# Altium project RoboBallPCB.PrjPcb
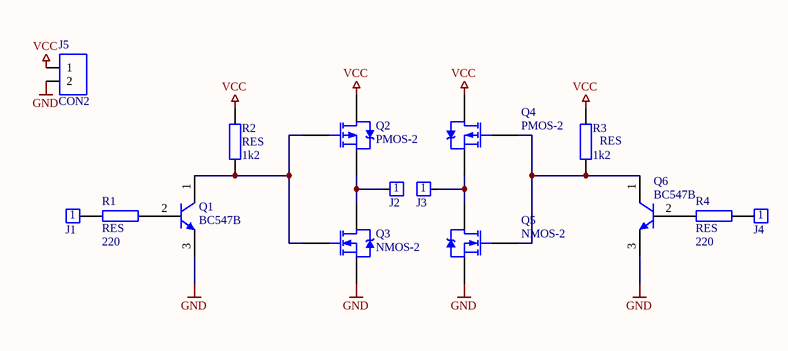
[diagram p0: RoboBallPCB.SchDoc]
1 sheet, 15 parts. Net scope: global (net labels, ports and power ports of the same name join across sheets).
Board file: RoboBallPCB.PcbDoc

## Sheet RoboBallPCB.SchDoc
size A4

### Parts
J1  CON1  [Pin1]  (value not drawn)
J2  CON1  [Pin1]  (value not drawn)
J3  CON1  [Pin1]  (value not drawn)
J4  CON1  [Pin1]  (value not drawn)
J5  CON2  [SIP-2]
Q1  BC547B  [TO-92/EBC]
Q2  PMOS-2  [TO-220AB]
Q3  NMOS-2  [TO-220AB]
Q4  PMOS-2  [TO-220AB]
Q5  NMOS-2  [TO-220AB]
Q6  BC547B  [TO-92/EBC]
R1  RES  value 220  [Axial-0.4]
R2  RES  value 1k2  [Axial-0.4]
R3  RES  value 1k2  [Axial-0.4]
R4  RES  value 220  [Axial-0.4]

### Nets
GND: J5.2 Q1.3(E) Q3.3(S) Q5.3(S) Q6.3(E)
VCC: J5.1 Q2.2(D) Q4.2(D) R2.2 R3.2
NetJ1_1: J1.1 R1.1
NetJ2_1: J2.1 Q2.3(S) Q3.2(D)
NetJ3_1: J3.1 Q4.3(S) Q5.2(D)
NetJ4_1: J4.1 R4.2
NetQ1_1: Q1.1(C) Q2.1(G) Q3.1(G) R2.1
NetQ1_2: Q1.2(B) R1.2
NetQ4_1: Q4.1(G) Q5.1(G) Q6.1(C) R3.1
NetQ6_2: Q6.2(B) R4.1

### Library data of the parts
J1-J4 = CON1: Stecker
J5 = CON2: Stecker
Q1 Q6 = BC546B: Amplifier Transistor NPN Silicon; pin to pad: 1>3 2>1 3>2; Published: 29-Sep-2000; LatestRevisionDate: 17-Jul-2002; LatestRevisionNote: Re-released for DXP Platform.; DatasheetVersion: 1991; PackageVersion: 1996; PackageReference: 29-04; Publisher: Altium Limited; PackageDescription: TO, Flat Index; 3 In-Line, Axial Leads; Body Dia. 4.8mm; Leads 0.48 x 0.5 mm (max); ComponentLink1Description: Manufacturer Link; ComponentLink1URL: http://www.onsemi.com/site/products/landing?taxonomyID=194; ComponentLink2Description: Datasheet; ComponentLink2URL: http://www.onsemi.com/pub/Collateral/BC546-D.PDF
Q2 Q4 = PMOS-2: P-Channel Power MOSFET; Note: Pin 4 not drawn and electrically connected to Pin 2.; Published: 8-Jun-2000; LatestRevisionDate: 17-Jul-2002; LatestRevisionNote: Re-released for DXP Platform.; DatasheetVersion: PD-9.390D; PackageVersion: Feb-1997; PackageReference: TO-220AB; Publisher: Altium Limited; PackageDescription: TO, Thru-Hole, Vertical, Heatsink Mounted; 3 In-Line Leads; Pitch 2.54 mm; ComponentLink1Description: Manufacturer Link; ComponentLink1URL: http://www.irf.com/
Q3 Q5 = NMOS-2: N-Channel Power MOSFET; Note: Pin 2 is electrically connected to pin 4.; Published: 8-Jun-2000; LatestRevisionDate: 17-Jul-2002; LatestRevisionNote: Re-released for DXP Platform.; DatasheetVersion: PD-9.814; PackageVersion: Feb-1997; PackageReference: TO-220AB; Publisher: Altium Limited; PackageDescription: TO, Thru-Hole, Vertical, Heatsink Mounted; 3 In-Line Leads; Pitch 2.54 mm; ComponentLink1Description: Manufacturer Link; ComponentLink1URL: http://www.irf.com/
R1-R4 = RES: Widerstand